# Altium schematic sheet MainPCBTARP.SchDoc
size A4; SheetNumber: 2; SheetTotal: 2
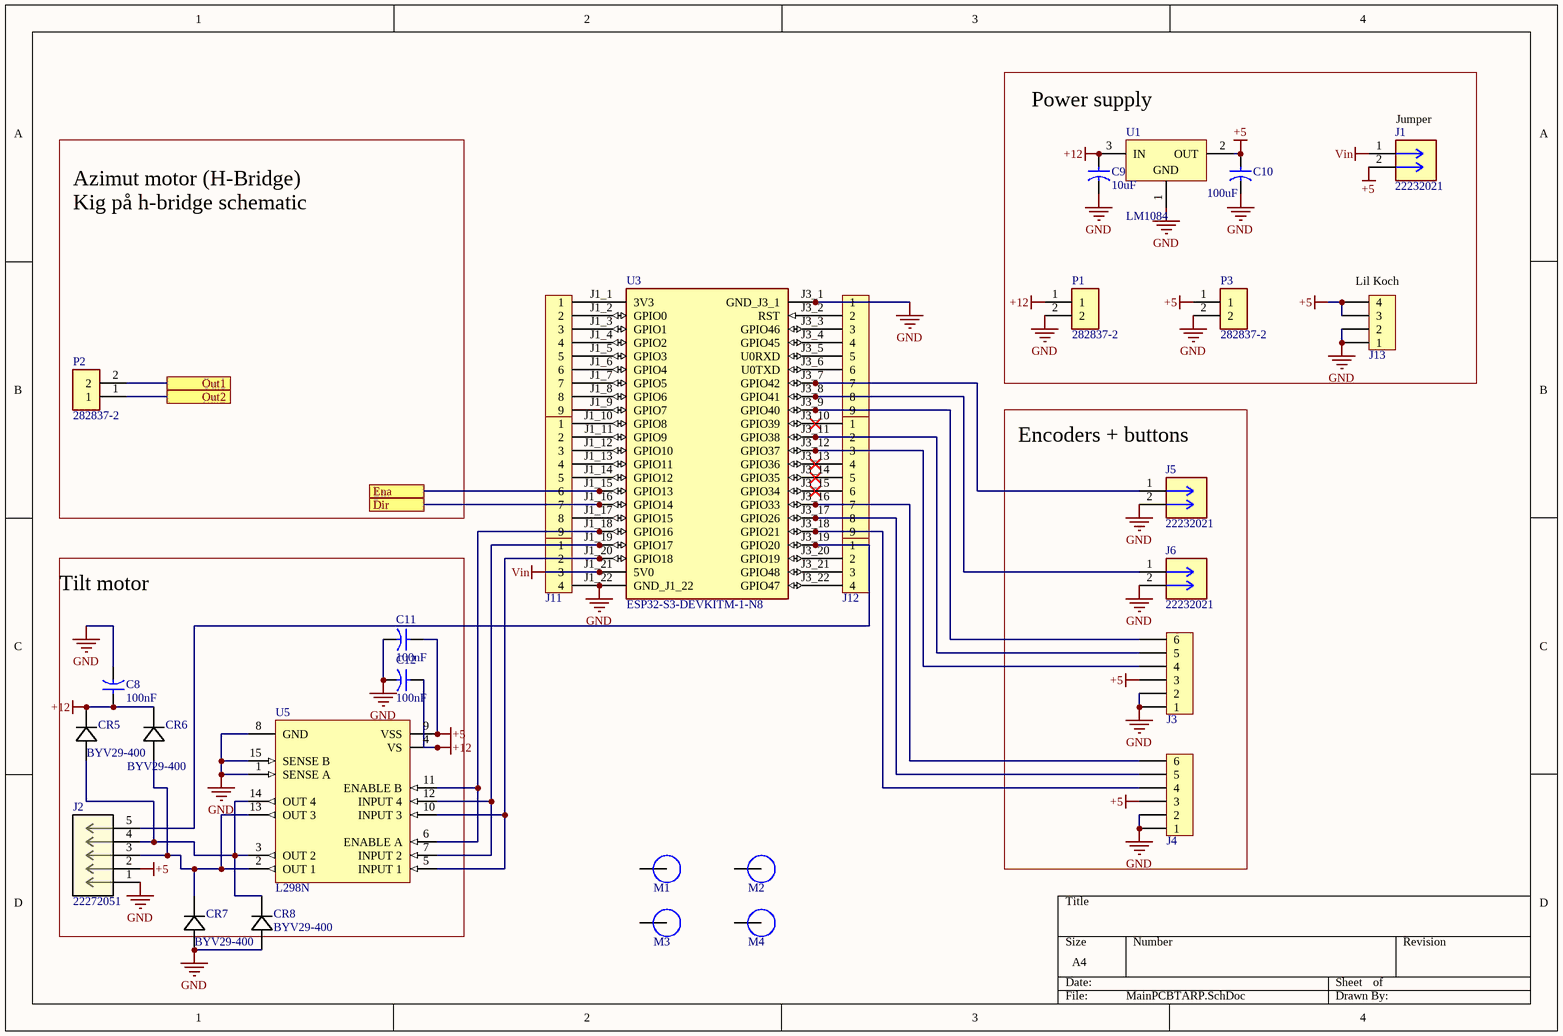
[diagram p0: MainPCBTARP.SchDoc]

## Parts
C8  value 100nF  [Cap Lyt Ø8]  (hidden comment: Cap)
C9  value 10uF  [Cap Lyt Ø8]  (hidden comment: Cap)
C10  value 100uF  [Cap Lyt Ø8]  (hidden comment: Cap)
C11  value 100nF  [Cap Lyt Ø8]  (hidden comment: Cap)
C12  value 100nF  [Cap Lyt Ø8]  (hidden comment: Cap)
CR5  BYV29-400  [SOD59_WEN]
CR6  BYV29-400  [SOD59_WEN]
CR7  BYV29-400  [SOD59_WEN]
CR8  BYV29-400  [SOD59_WEN]
J1  22232021  [CONN_A-6373-02A_MOL]
J2  22272051  [CONN_AE-6410-05A_MOL]
J3  Header 1x6  [Header 1x6]  (value not drawn)
J4  Header 1x6  [Header 1x6]  (value not drawn)
J5  22232021  [CONN_A-6373-02A_MOL]
J6  22232021  [CONN_A-6373-02A_MOL]
J7  Header 1x9  [Header 1x9]  (value not drawn)
J8  Header 1x9  [Header 1x9]  (value not drawn)
J9  Header 1x9  [Header 1x9]  (value not drawn)
J10  Header 1x9  [Header 1x9]  (value not drawn)
J11  Header 1x4  [Header 1x4]  (value not drawn)
J12  Header 1x4  [Header 1x4]  (value not drawn)
J13  Header 1x4  [Header 1x4]  (value not drawn)
M1  Screw Hole  [M3 Hole]  (value not drawn)  (no BOM)
M2  Screw Hole  [M3 Hole]  (value not drawn)  (no BOM)
M3  Screw Hole  [M3 Hole]  (value not drawn)  (no BOM)
M4  Screw Hole  [M3 Hole]  (value not drawn)  (no BOM)
P1  282837-2  [TE_282837-2]
P2  282837-2  [TE_282837-2]
P3  282837-2  [TE_282837-2]
U1  LM1084  [T03B]
U3  ESP32-S3-DEVKITM-1-N8  [MODULE_ESP32-S3-DEVKITM-1-N8]
U5  L298N  [STM-FM-15]

## Blocks framed on the sheet
Power supply: C9 C10 J1 J13 P1 P3 U1

## Ports
Dir (see H-bridge[1A]), Ena (see H-bridge[1B]), Out1 (see H-bridge[2C]), Out2 (see H-bridge[2C])

## Nets
+5: C10.1 C11.1 J1.2 J2.2 J3.3 J4.3 J13.3 J13.4 P3.1 U1.2(OUT) U5.9(VSS)
+12: C8.1 C9.1 C12.1 CR5.1 CR6.1 P1.1 U1.3(IN) U5.4(VS)
GND: C8.2(g) C9.2(g) C10.2(g) C11.2(g) C12.2(g) CR7.2 CR8.2 J2.1 J3.1 J3.2 J4.1 J4.2 J5.2 J6.2 J7.1 J11.4 J13.1 J13.2 P1.2 P3.2 U1.1(GND) U3.J1_22(GND_J1_22) U3.J3_1(GND_J3_1) U5.1(SENSE_A) U5.8(GND) U5.15(SENSE_B)
Vin: J1.1 J11.3 U3.J1_21(5V0)
Dir: J10.7 U3.J1_16(GPIO14) ; port Dir
Ena: J10.6 U3.J1_15(GPIO13) ; port Ena
Out1: P2.2 ; port Out1
Out2: P2.1 ; port Out2
NetCR5_2: CR5.2 CR8.1 J2.4 U5.3(OUT_2) U5.14(OUT_4)
NetCR6_2: CR6.2 CR7.1 J2.3 U5.2(OUT_1) U5.13(OUT_3)
NetJ2_5: J2.5 J12.1 U3.J3_19(GPIO20)
NetJ3_4: J3.4 J9.3 U3.J3_12(GPIO37)
NetJ3_5: J3.5 J9.2 U3.J3_11(GPIO38)
NetJ3_6: J3.6 J7.9 U3.J3_9(GPIO40)
NetJ4_4: J4.4 J9.9 U3.J3_18(GPIO21)
NetJ4_5: J4.5 J9.8 U3.J3_17(GPIO26)
NetJ4_6: J4.6 J9.7 U3.J3_16(GPIO33)
NetJ5_1: J5.1 J7.7 U3.J3_7(GPIO42)
NetJ6_1: J6.1 J7.8 U3.J3_8(GPIO41)
NetJ7_2: J7.2 U3.J3_2(RST)
NetJ7_3: J7.3 U3.J3_3(GPIO46)
NetJ7_4: J7.4 U3.J3_4(GPIO45)
NetJ7_5: J7.5 U3.J3_5(U0RXD)
NetJ7_6: J7.6 U3.J3_6(U0TXD)
NetJ8_1: J8.1 U3.J1_1(3V3)
NetJ8_2: J8.2 U3.J1_2(GPIO0)
NetJ8_3: J8.3 U3.J1_3(GPIO1)
NetJ8_4: J8.4 U3.J1_4(GPIO2)
NetJ8_5: J8.5 U3.J1_5(GPIO3)
NetJ8_6: J8.6 U3.J1_6(GPIO4)
NetJ8_7: J8.7 U3.J1_7(GPIO5)
NetJ8_8: J8.8 U3.J1_8(GPIO6)
NetJ8_9: J8.9 U3.J1_9(GPIO7)
NetJ9_1: J9.1 U3.J3_10(GPIO39)
NetJ9_4: J9.4 U3.J3_13(GPIO36)
NetJ9_5: J9.5 U3.J3_14(GPIO35)
NetJ9_6: J9.6 U3.J3_15(GPIO34)
NetJ10_1: J10.1 U3.J1_10(GPIO8)
NetJ10_2: J10.2 U3.J1_11(GPIO9)
NetJ10_3: J10.3 U3.J1_12(GPIO10)
NetJ10_4: J10.4 U3.J1_13(GPIO11)
NetJ10_5: J10.5 U3.J1_14(GPIO12)
NetJ10_8: J10.8 U3.J1_17(GPIO15)
NetJ10_9: J10.9 U3.J1_18(GPIO16) U5.6(ENABLE_A) U5.11(ENABLE_B)
NetJ11_1: J11.1 U3.J1_19(GPIO17) U5.7(INPUT_2) U5.12(INPUT_4)
NetJ11_2: J11.2 U3.J1_20(GPIO18) U5.5(INPUT_1) U5.10(INPUT_3)
NetJ12_2: J12.2 U3.J3_20(GPIO19)
NetJ12_3: J12.3 U3.J3_21(GPIO48)
NetJ12_4: J12.4 U3.J3_22(GPIO47)

Not connected (* = marked no-connect by the designer): M1 1; M2 1; M3 1; M4 1

## Notes on the sheet
- (near J1) Jumper
- Azimut motor (H-Bridge)
  Kig på h-bridge schematic
- (near J13) Lil Koch
- (near J5) Encoders + buttons
- Tilt motor

## Library data of the parts
C8-C12 = Capacitor electrolytic
CR5-CR8 = BYV29-500: No Description Available; Manufacturer_Name: WeEN Semiconductors; Copyright: Copyright (C) 2025 Ultra Librarian. All rights reserved.; Manufacturer_Part_Number: BYV29-500
J1 J5 J6 = CMP-005-000000-1: Connector Header Through Hole 2 position 0.100 (2.54mm); MF: Molex; Check_prices: https://www.snapeda.com/parts/22232021/Molex/view-part/?ref=eda; Design Item ID: 22232021; MP: 22232021; Component Type: Standard; Source: 22232021.SchLib; Value: *; Package: None; Pin Count: 2; SnapEDA_Link: https://www.snapeda.com/parts/22232021/Molex/view-part/?ref=snap
J2 = 22272051: KK 254 Wire-to-Board Header, Vertical, with Friction Lock, 5 Circuits, Tin (Sn) Plating; Manufacturer_Name: Molex Connector Corporation; Copyright: Copyright (C) 2025 Ultra Librarian. All rights reserved.; Manufacturer_Part_Number: 22272051; Datasheet: https://www.molex.com/en-us/products/part-detail-pdf/22272051?display=pdf; RefDes: RefDes; Type: Type
P1-P3 = CMP-007-000000-1: Ð Ð°Ð·ÑŠÐµÐ¼Ð½Ñ‹Ðµ ÐºÐ»ÐµÐ¼Ð¼Ð½Ñ‹Ðµ ÐºÐ¾Ð»Ð¾Ð´ÐºÐ¸ Ð Ð¾Ð·ÐµÑ‚ÐºÐ° 2 Ð¿Ð¾Ð»Ð¾Ð¶ÐµÐ½Ð¸Ñ 5,08 Ð¼Ð¼ ÐŸÑ€Ð¸Ð¿Ð¾Ð¹ Ð¿Ñ€ÑÐ¼Ð¾Ð¹ Ñ‡ÐµÑ€ÐµÐ· Ð¾Ñ‚Ð²ÐµÑ€ÑÑ‚Ð¸Ðµ 13,5 Ð / ÐºÐ¾Ð½Ñ‚Ð°ÐºÑ‚; MF: TE Connectivity; Price: None; MP: 282837-2; Check_prices: https://www.snapeda.com/parts/282837-2/TE+Connectivity+AMP+Connectors/view-part/?ref=eda; Value: *; Pin Count: 2; SnapEDA_Link: https://www.snapeda.com/parts/282837-2/TE+Connectivity+AMP+Connectors/view-part/?ref=snap; Component Type: Standard; Purchase-URL: https://pricing.snapeda.com/search/part/282837-2/?ref=eda; Availability: In Stock; Package: None; Source: 282837-2.SchLib; Design Item ID: 282837-2
U1 = CMP-0062-02512-2: 1.5A Low Dropout Positive Regulators, 3-pin TO-220; Manufacturer: National Semiconductor; PackageTopMarking: NSUZXYTTE#*LM1086*CT-3.3; CompType: LDO IC; PowerWise: N; ComponentLink1Description: LM1086 Datasheet; ComponentLink2Description: LM1086 Web Page; ComponentLink1URL: http://www.national.com/ds/LM/LM1086.pdf; PackageReference: T03B; PackageVersion: revL, Jan-1992; RoHS: N; DatasheetVersion: Jun-2005; PinCount: 3; ComponentLink2URL: http://www.national.com/pf/LM/LM1086.html; RevisionNote: Component URLs added; ComponentLink3Description: T03B Package Page; PackageDescription: TO-220, Molded, 3 Lead, Straight; ComponentLink3URL: http://www.national.com/packaging/folders/t03b.html
U3 = CMP-003-000000-1: MF: {'manufacturer': u'Espressif Systems'}; Package: None; Value: *; Source: ESP32-S3-DEVKITM-1-N8.SchLib; Design Item ID: ESP32-S3-DEVKITM-1-N8; Price: None; Component Type: Standard; Availability: Unavailable; Pin Count: 44; MP: ESP32-S3-DEVKITM-1-N8
U5 = CMP-2000-06526-1: Dual Full-Bridge Driver, 4.8 to 46 V, -40 to 150 degC, 15-Pin FM (MW 15L), RoHS, Tube; Manufacturer: STMicroelectronics; PartNumber: L298; Output Current: 2A; Supply Voltage Max: 7V; Driver Case Style: Multiwatt; Supply Voltage Min: 4.5V; No. of Pins: 15Pins; SVHC: NoSVHC(17-Dec-2015); Output Voltage: 46V; No. of Outputs: 4Outputs; Motor Type: FullBridge; MSL: -; Package Description: 15-Pin Flange Mount, Body 5 x 19.6 mm, Pitch 1.27 mm; Datasheet Version: 01/2000; Package Reference: FM-15; Mounting Technology: ThroughHole; Packaging: Each; Automotive Qualification Standard: -; Product Range: -; Datasheet URL: https://datasheet.ciiva.com/15109/getdatasheetpartid-50682-15109332.pdf; Operating Temperature Max: 130°C; Operating Temperature Min: -25°C; Manufacturer URL: http://www.st.com/